# Altium schematic sheet DOT_LED.SchDoc: =project_title
size Tabloid; CompanyName: Luxonis Holding; Organization: Luxonis Holding; Address1: 1925 Harmony Park Drive; Address2: Westminster, CO; Address3: 80234; Address4: United States; SheetNumber: 13; SheetTotal: 13
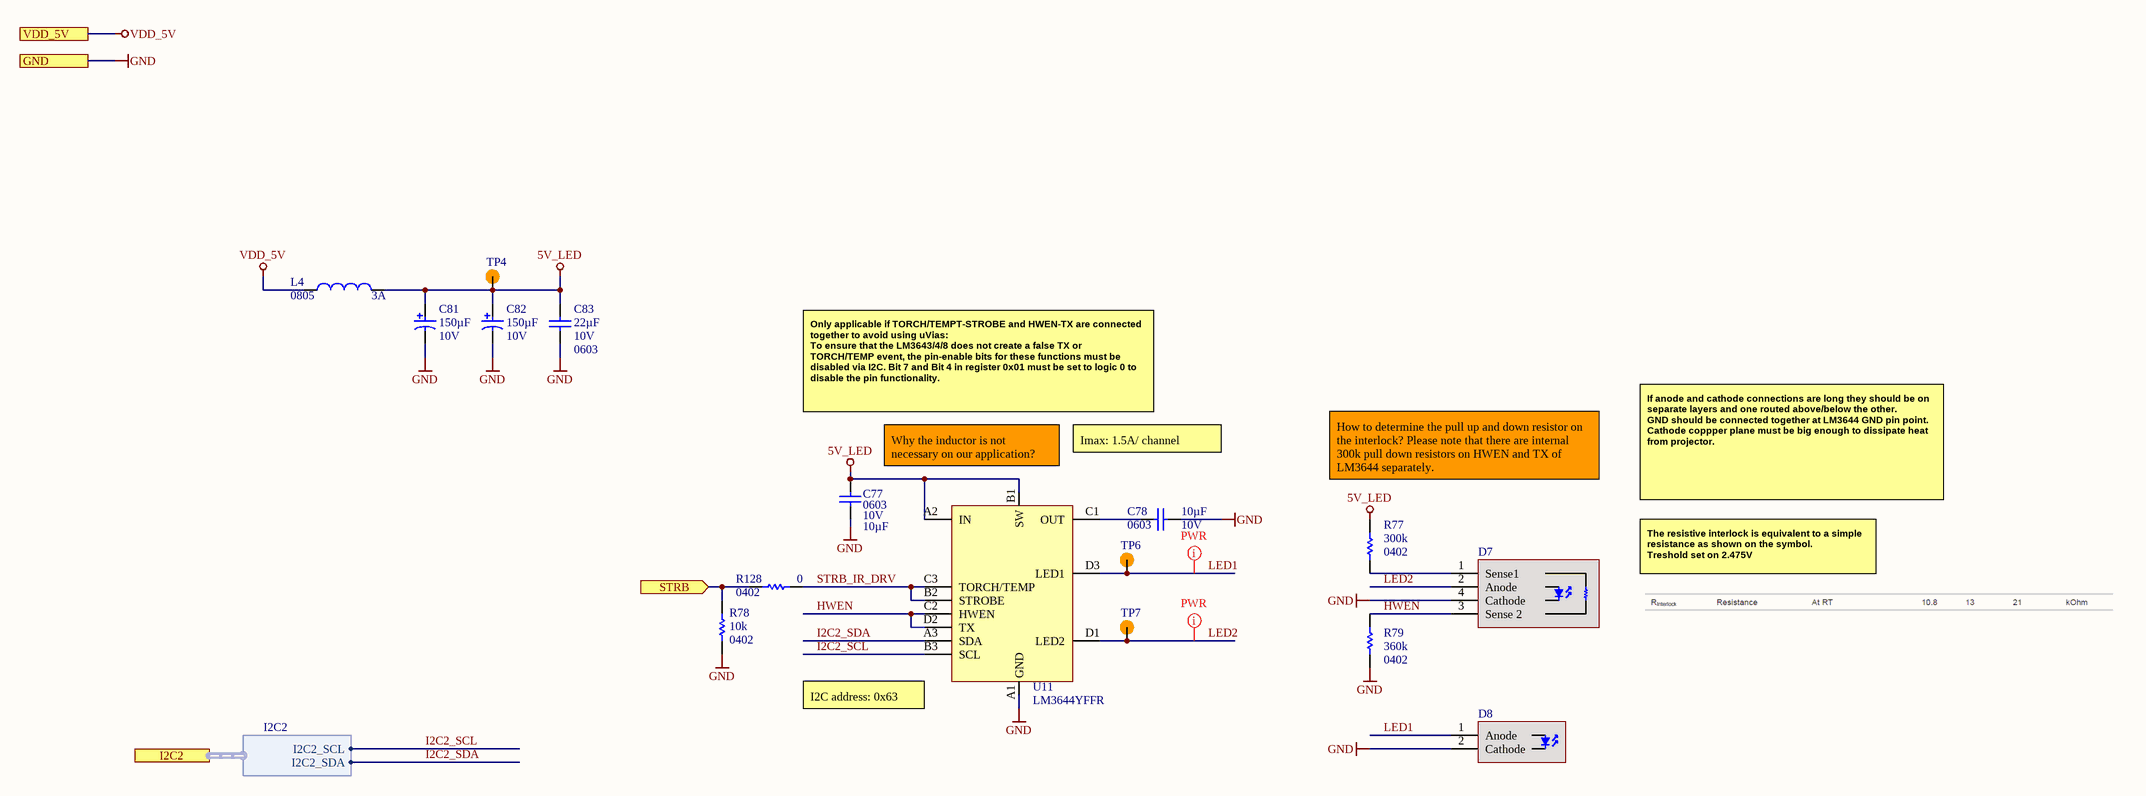
[diagram p0: DOT_LED.SchDoc]

## Parts
C77  value 10µF  Case/Package: 0603  Voltage Rating: 10V  [CAPC0603(1608)100_L]  (hidden comment: GRM188R61A106ME69D)
C78  value 10µF  Case/Package: 0603  Voltage Rating: 10V  [CAPC0603(1608)100_L]  (hidden comment: GRM188R61A106ME69D)
C81  value 150µF  Voltage Rating: 10V  [RESTL1210(3225)_L]  (hidden comment: TLJB157M010R0500)
C82  value 150µF  Voltage Rating: 10V  [RESTL1210(3225)_L]  (hidden comment: TLJB157M010R0500)
C83  value 22µF  Voltage Rating: 10V  Case/Package: 0603  [CAPC0603(1608)100_N]  (hidden comment: GRM188R61A226ME15D)
D7  BELAGO1.1  [Belago1.1]  (value not drawn)
D8  SFH 4725AS  [SFH 4715AS]  (value not drawn)
L4  Current Rating: 3A  Case/Package: 0805  [SMD-0805]  (hidden comment: 742792011)
R77  value 300k  Case/Package: 0402  [RESC0402(1005)_N]  (hidden comment: RC0402FR-07300KL)
R78  value 10k  Case/Package: 0402  [RESC0402(1005)_N]  (hidden comment: RC0402FR-1310KL)
R79  value 360k  Case/Package: 0402  [RESC0402(1005)_N]  (hidden comment: RC0402FR-07360KL)
R128  value 0  Case/Package: 0402  [RESC0402(1005)_L]  (hidden comment: CRCW04020000Z0ED)
TP4  TEST_POINT  [TP075_150_NS]  (value not drawn)  (no BOM)
TP6  TEST_POINT  [TP075_150_NS]  (value not drawn)  (no BOM)
TP7  TEST_POINT  [TP075_150_NS]  (value not drawn)  (no BOM)
U11  LM3644YFFR  [LM3644YFFR]

## Ports
GND, I2C2 (harness I2C2), STRB (in), VDD_5V

## Harnesses
I2C2: I2C2_SDA, I2C2_SCL

## Nets
5V_LED: C77.2 C81.1 C82.1 C83.2 L4.2 R77.2 TP4.1 U11.A2(IN) U11.B1(SW)
GND: C77.1 C78.2 C81.2 C82.2 C83.1 D7.4(Cathode) D8.2(Cathode) R78.1 R79.1 U11.A1(GND) ; port GND
VDD_5V: L4.1 ; port VDD_5V
HWEN: D7.3(Sense_2) R79.2 U11.C2(HWEN) U11.D2(TX)
I2C2_SCL: U11.B3(SCL) ; port I2C2.I2C2_SCL
I2C2_SDA: U11.A3(SDA) ; port I2C2.I2C2_SDA
LED1: D8.1(Anode) TP6.1 U11.D3(LED1)
LED2: D7.2(Anode) TP7.1 U11.D1(LED2)
STRB: R78.2 R128.2 ; port STRB
STRB_IR_DRV: R128.1 U11.B2(STROBE) U11.C3(TORCH/TEMP)
NetC78_1: C78.1 U11.C1(OUT)
NetD7_1: D7.1(Sense1) R77.1

## Layout directives
net class PWR; Current Rating: 2A: LED1, LED2

## Notes on the sheet
- Only applicable if TORCH/TEMPT-STROBE and HWEN-TX are connected together to avoid using uVias:
  To ensure that the LM3643/4/8 does not create a false TX or TORCH/TEMP event, the pin-enable bits for these functions must be disabled via I2C. Bit 7 and Bit 4 in register 0x01 must be set to logic 0 to disable the pin functionality.
- Why the inductor is not necessary on our application?
- Imax: 1.5A/ channel
- How to determine the pull up and down resistor on the interlock? Please note that there are internal 300k pull down resistors on HWEN and TX of LM3644 separately.
- If anode and cathode connections are long they should be on separate layers and one routed above/below the other.
  GND should be connected together at LM3644 GND pin point.
  Cathode coppper plane must be big enough to dissipate heat from projector.
- The resistive interlock is equivalent to a simple resistance as shown on the symbol.
  Treshold set on 2.475V
- (near U11) I2C address: 0x63
- Title
- Size:
- Date:
- Tabloid
- Number:
- Time:
- Revision:
- Sheet
- of
- Drawn by:

## Library data of the parts
C77 C78 = CMP-004-000018-4: CAP CER 10UF 10V X5R 0603 20%; Manufacturer 1: Murata; Manufacturer Part Number 1: GRM188R61A106ME69D; Min Operating Temperature: -55°C; Max Operating Temperature: 85°C; Tolerance: 20%; Dielectric: X5R; Length: 1.6mm; Height: 0.8mm; Width: 0.8mm; Depth: 0.8mm; ComponentLink1URL: http://www.mouser.com/ds/2/281/c02e-2905.pdf?src-supplier=Mouser; ComponentLink1Description: http://www.mouser.com/ds/2/281/c02e-2905.pdf?src-supplier=Mouser; ComponentLink2URL: http://components.arrow.com/part/dataview/0323_06119472?src-supplier=Arrow+Europe; ComponentLink2Description: http://components.arrow.com/part/dataview/0323_06119472?src-supplier=Arrow+Europe; ComponentLink3URL: http://www.farnell.com/datasheets/2048014.pdf?src-supplier=Farnell; ComponentLink3Description: http://www.farnell.com/datasheets/2048014.pdf?src-supplier=Farnell; ComponentLink4URL: http://www.farnell.com/datasheets/1872210.pdf?src-supplier=Farnell; ComponentLink4Description: http://www.farnell.com/datasheets/1872210.pdf?src-supplier=Farnell; ComponentLink5URL: http://search.murata.co.jp/Ceramy/image/img/A01X/G101/ENG/GRM188R61A106ME69-01.pdf?src-supplier=Digi-Key; ComponentLink5Description: http://search.murata.co.jp/Ceramy/image/img/A01X/G101/ENG/GRM188R61A106ME69-01.pdf?src-supplier=Digi-Key; ComponentLink6URL: http://www.farnell.com/datasheets/1872210.pdf?src-supplier=Newark; ComponentLink6Description: http://www.farnell.com/datasheets/1872210.pdf?src-supplier=Newark; ComponentLink7URL: http://www.farnell.com/datasheets/2048014.pdf?src-supplier=Element14; ComponentLink7Description: http://www.farnell.com/datasheets/2048014.pdf?src-supplier=Element14; ComponentLink8URL: http://www.farnell.com/datasheets/2048014.pdf?src-supplier=Newark; ComponentLink8Description: http://www.farnell.com/datasheets/2048014.pdf?src-supplier=Newark; Design Item ID: GRM188R61A106ME69D; Mounting Technology: SMT
C81 C82 = CMP-050-000000-4: CAP TAL 150UF 10V 20%; Manufacturer 1: Kyocera AVX; Polarity: Polarized; Capacitor Type: Tantalum; ComponentLink10URL: https://datasheet.ciiva.com/7773/1533257-7773834.pdf?src-supplier=Element14; ComponentLink1Description: https://datasheet.ciiva.com:443/pdfs/VipMasterIC/IC/AVXC/AVXC-S-A0008508048/AVXC-S-A0008508048-1.pdf?src-supplier=IHS+Markit; ComponentLink12Description: https://datasheet.ciiva.com/17339/tlj-17339422.pdf?src-supplier=Avnet+Europe; Min Operating Temperature: -55°C; ComponentLink12URL: https://datasheet.ciiva.com/17339/tlj-17339422.pdf?src-supplier=Avnet+Europe; ComponentLink1URL: https://datasheet.ciiva.com:443/pdfs/VipMasterIC/IC/AVXC/AVXC-S-A0008508048/AVXC-S-A0008508048-1.pdf?src-supplier=IHS+Markit; ComponentLink3URL: https://datasheet.ciiva.com/264/tlj-264787.pdf?src-supplier=Digi-Key; ComponentLink9URL: https://datasheet.ciiva.com/14606/70001364-14606409.pdf?src-supplier=Allied+Electronics; ComponentLink7URL: https://datasheet.ciiva.com/7773/1533257-7773833.pdf?src-supplier=Element14; ComponentLink4URL: https://datasheet.ciiva.com/264/tlj-264788.pdf?src-supplier=Digi-Key; Design Item ID: TLJB157M010R0500; ComponentLink8Description: https://datasheet.ciiva.com/14593/70001364-14593673.pdf?src-supplier=Allied+Electronics; ComponentLink6Description: https://datasheet.ciiva.com/28515/tlj-28515528.pdf?src-supplier=Element14; ComponentLink4Description: https://datasheet.ciiva.com/264/tlj-264788.pdf?src-supplier=Digi-Key; ComponentLink2Description: https://datasheet.ciiva.com/264/tlj-264786.pdf?src-supplier=Digi-Key; Manufacturer Part Number 1: TLJB157M010R0500; ComponentLink11URL: https://datasheet.ciiva.com/11229/tlj-11229389.pdf?src-supplier=Avnet; ComponentLink9Description: https://datasheet.ciiva.com/14606/70001364-14606409.pdf?src-supplier=Allied+Electronics; Max Operating Temperature: 125°C; ComponentLink5URL: https://datasheet.ciiva.com/46385/1910903-46385237.pdf?src-supplier=Element14; Width: 2.8mm; ComponentLink7Description: https://datasheet.ciiva.com/7773/1533257-7773833.pdf?src-supplier=Element14; ComponentLink8URL: https://datasheet.ciiva.com/14593/70001364-14593673.pdf?src-supplier=Allied+Electronics; ComponentLink6URL: https://datasheet.ciiva.com/28515/tlj-28515528.pdf?src-supplier=Element14; Length: 3.5mm; Height: 1.9mm; ComponentLink5Description: https://datasheet.ciiva.com/46385/1910903-46385237.pdf?src-supplier=Element14; ComponentLink2URL: https://datasheet.ciiva.com/264/tlj-264786.pdf?src-supplier=Digi-Key; ComponentLink11Description: https://datasheet.ciiva.com/11229/tlj-11229389.pdf?src-supplier=Avnet; ComponentLink10Description: https://datasheet.ciiva.com/7773/1533257-7773834.pdf?src-supplier=Element14; ComponentLink3Description: https://datasheet.ciiva.com/264/tlj-264787.pdf?src-supplier=Digi-Key; Tolerance: 20%; Mounting Technology: SMT; Case/Package: 1411
C83 = CMP-108-000020-4: CAP CER 22UF 10V X5R 0603 20%; Manufacturer 1: Murata; Tolerance: 20%; Max Operating Temperature: 85°C; ComponentLink1Description: https://datasheet.ciiva.com/46444/1769893-46444975.pdf?src-supplier=Element14; Min Operating Temperature: -55°C; Manufacturer Part Number 1: GRM188R61A226ME15D; Mounting Technology: SMT; Depth: 0.8mm; Design Item ID: GRM188R61A226ME15D; Height: 0.8mm; Dielectric: X5R; Width: 0.8mm; Length: 1.6mm; ComponentLink1URL: https://datasheet.ciiva.com/46444/1769893-46444975.pdf?src-supplier=Element14
D7 = CMP-004-00032-3: Dot-Pattern Infrared Illuminator for 3D Stereoscopic / Imaging AQAA-20; Manufacturer Part Number 1: Belago1.1 AQAA-20
D8 = CMP-004-00043-2: OSLON Black Series (940 nm) - 80°; Manufacturer Part Number 1: SFH 4725AS A01
L4 = CMP-006-00026-2: Ferrite Chip, 1 Function(s), 3A, 2 Pin(s); Manufacturer 1: Wurth electronic; Manufacturer Part Number 1: 742792011
R77 = CMP-013-000049-8: RES SMD 300K OHM 1% 1/16W 0402; Manufacturer 1: Yageo; Voltage Rating: 50V; Power Rating: 63mW; Tolerance: 1%; Design Item ID: RC0402FR-07300KL; Max Operating Temperature: 155°C; Manufacturer Part Number 1: RC0402FR-07300KL; Min Operating Temperature: -55°C
R78 = CMP-115-000004-8: RES SMD 10K OHM 1% 1/16W 0402; Manufacturer 1: Yageo; Power Rating: 62.5mW; Temperature Coefficient: 100ppm/°C; Voltage Rating: 50V; Min Operating Temperature: -55°C; Max Operating Temperature: 155°C; Design Item ID: RC0402FR-1310KL; Tolerance: 1%; Manufacturer Part Number 1: RC0402FR-1310KL
R79 = CMP-013-000051-9: RES SMD 360K OHM 1% 1/16W 0402; Manufacturer 1: Yageo; Power Rating: 62.5mW; Min Operating Temperature: -55°C; Design Item ID: RC0402FR-07360KL; Max Operating Temperature: 155°C; Tolerance: 1%; Manufacturer Part Number 1: RC0402FR-07360KL
R128 = CMP-013-000022-11: RES SMD 0 OHM 5% 1/16W 0402; Manufacturer 1: Vishay; Voltage Rating: 50V; Power Rating: 63mW; Max Operating Temperature: 155°C; Manufacturer Part Number 1: CRCW04020000Z0ED; Tolerance: 5%; Min Operating Temperature: -55°C; Design Item ID: CRCW04020000Z0ED
TP4 TP6 TP7 = CMP-015-000000-2: Manufacturer Part Number 1: /; Source: LuxonisMaster.SchLib; Design Item ID: TEST_POINT
U11 = CMP-006-000006-2: LED Driver, 2-Segment, PBGA12; Manufacturer 1: Texas Instruments; Multiplexed Display Capability: No; Data Input Mode: SERIAL; Package Body Material: Plastic; Min Supply Voltage: 2.5V; Number of Segments: 2; Supply Voltage-Nom: 3.6V; Number of Functions: 1; Max Supply Voltage: 5.5V; Interface IC Type: LED DISPLAY DRIVER; Category: LED Drivers; ComponentLink2URL: https://datasheet.ciiva.com/48475/lm3644-48475318.pdf?src-supplier=Avnet; Pricing 1: 1=0,64580, 10=0,63600, 25=0,62590, 100=0,61590, 250=0,60610, 500=0,59600, 1000=0,58600, 3000=0,35000, 30000=0,34520, 300000=0,31610, 1500000=0,29870, 3000000=0,29850 (USD); Peak Reflow Temperature (Cel): 260°C; Package Shape: Rectangular; Temperature Grade: INDUSTRIAL; Source: DM9098.SchLib; Moisture Sensitivity Level: 1; Stock 1: 2033; Surface Mount: Yes; RoHS Compliant: Yes; Package Style: GRID ARRAY, VERY THIN PROFILE, FINE PITCHMeter; Terminal Finish: Copper; REACH SVHC: Yes; JESD-609 Code: e1; Terminal Position: BOTTOM; Length: 1.66mm; Height - Seated (Max): 0.625mm; RoHS: Yes; Number of Pins: 12; Manufacturer Part Number 1: LM3644YFFR; Package Code: VFBGA; ComponentLink1URL: https://www.ti.com:443/lit/ds/symlink/lm3644.pdf?src-supplier=IHS+Markit; Width: 1.28mm; Min Operating Temperature: -40°C; ComponentLink1Description: https://www.ti.com:443/lit/ds/symlink/lm3644.pdf?src-supplier=IHS+Markit; Terminal Pitch: 0.4mm; ComponentLink2Description: https://datasheet.ciiva.com/48475/lm3644-48475318.pdf?src-supplier=Avnet; Terminal Form: Ball; Max Operating Temperature: 85°C; Design Item ID: LM3644